# Altium schematic sheet DDR3.SchDoc: POLYSOME CRYPTO 01
size A3; Revision: V1; SheetNumber: 5; SheetTotal: 8; ProjectName: POLYSOME CRYPTO 01
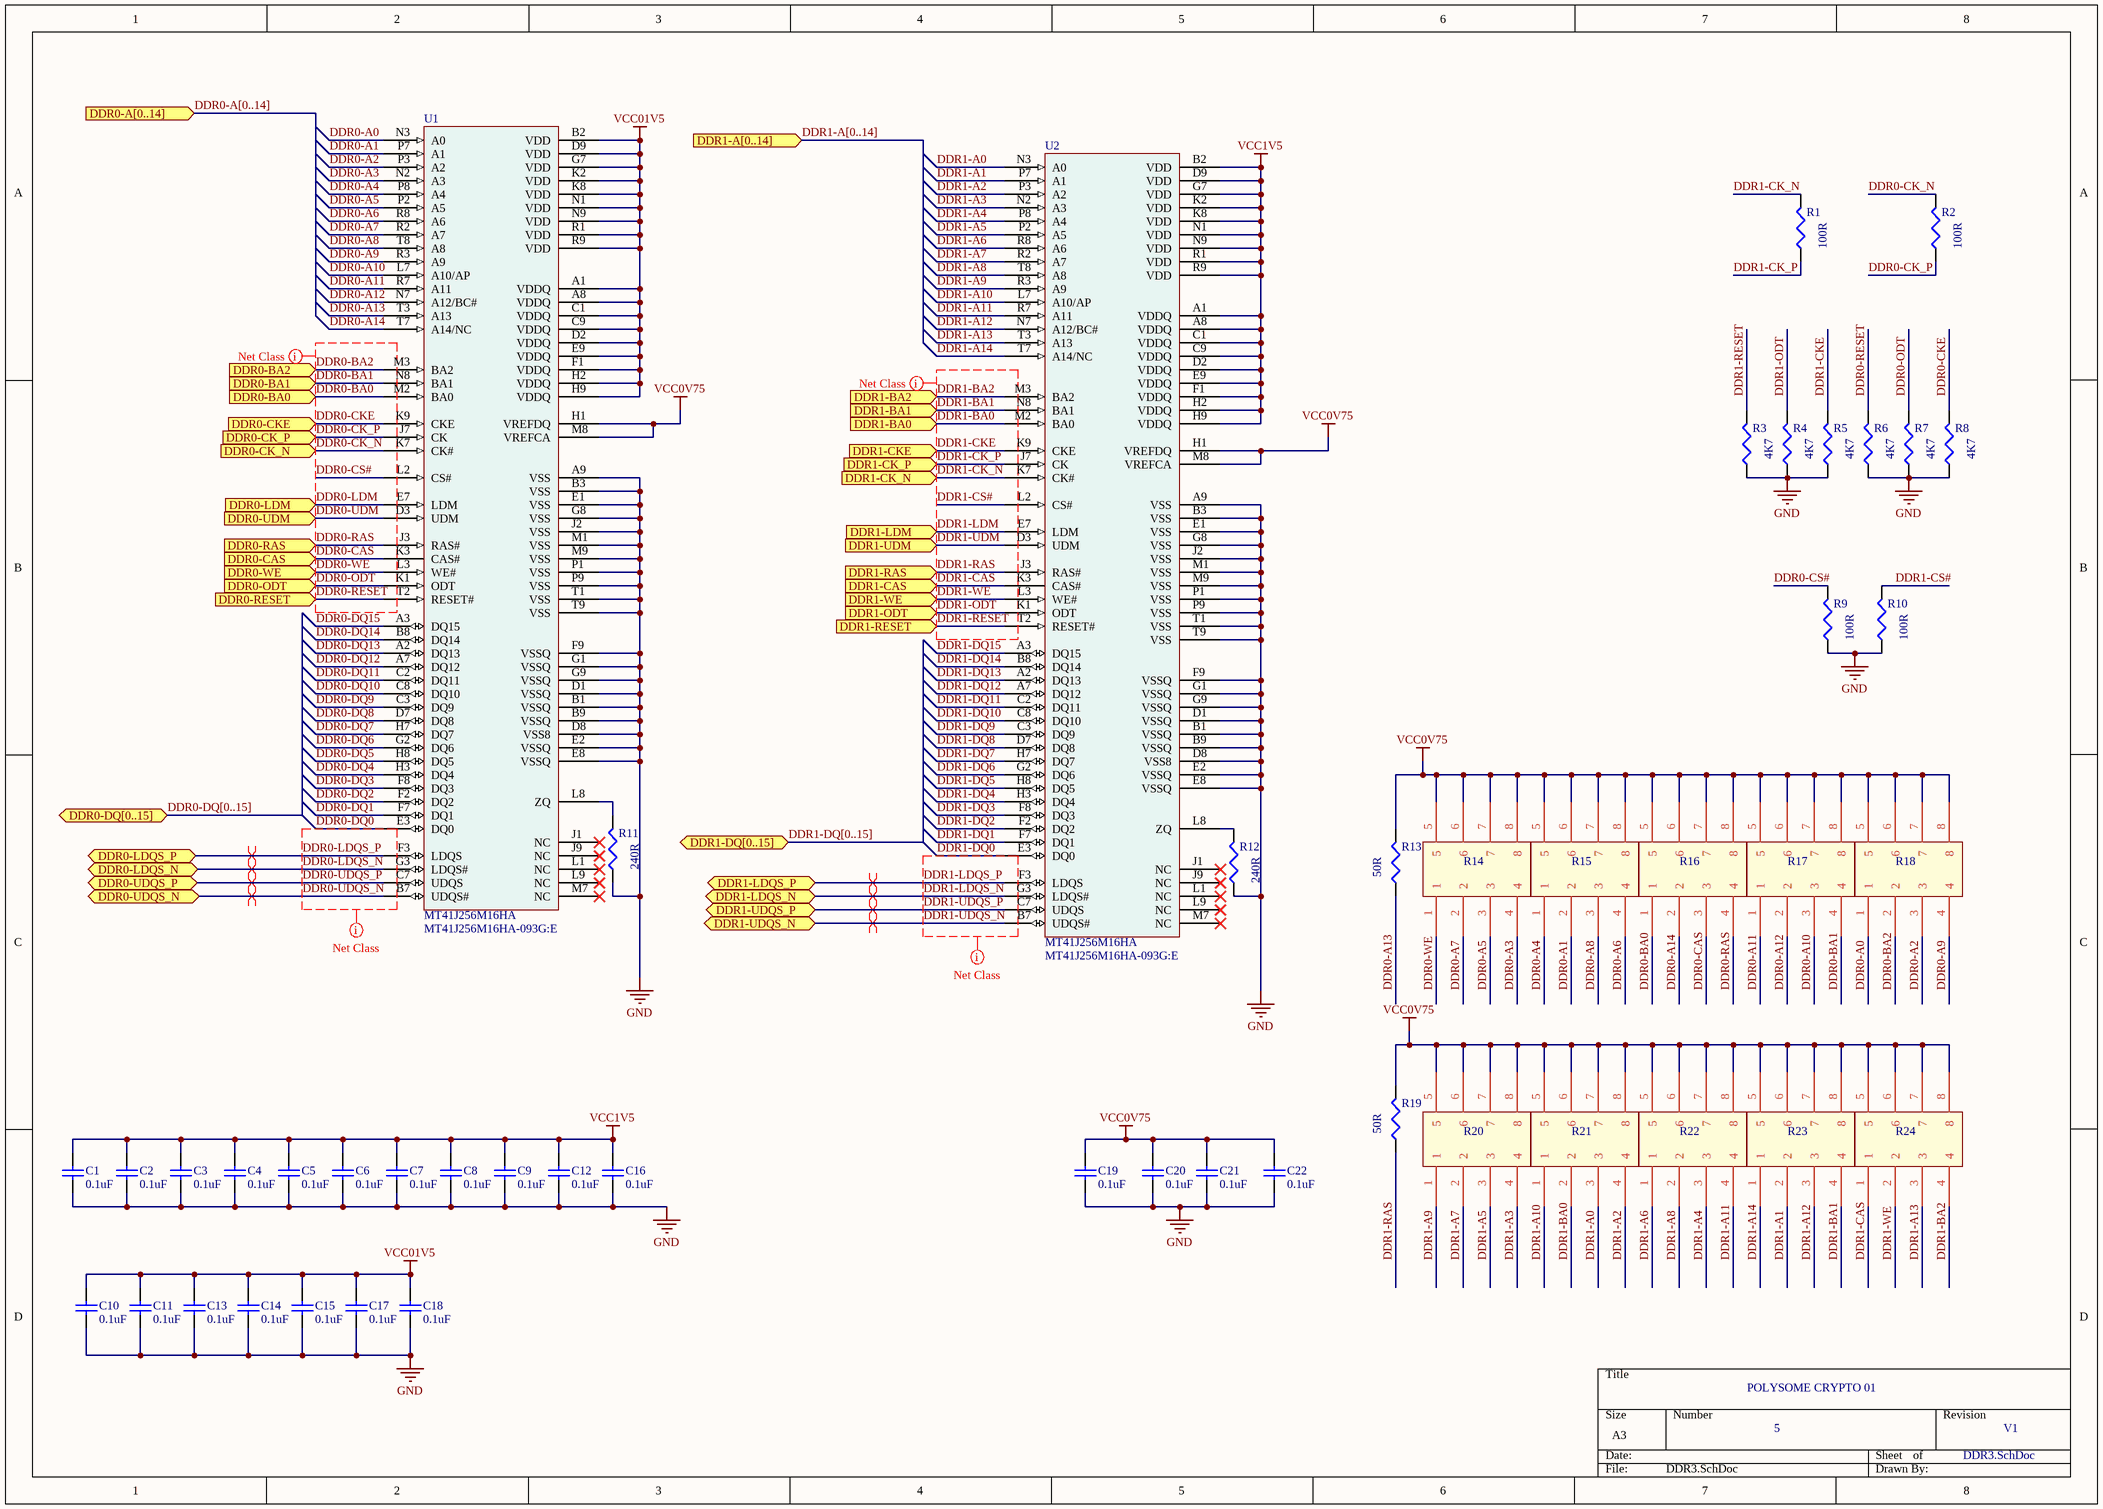
[diagram p0: DDR3.SchDoc]

## Parts
C1  value 0.1uF  [0402]  (hidden comment: Cap Semi)
C2  value 0.1uF  [0402]  (hidden comment: Cap Semi)
C3  value 0.1uF  [0402]  (hidden comment: Cap Semi)
C4  value 0.1uF  [0402]  (hidden comment: Cap Semi)
C5  value 0.1uF  [0402]  (hidden comment: Cap Semi)
C6  value 0.1uF  [0402]  (hidden comment: Cap Semi)
C7  value 0.1uF  [0402]  (hidden comment: Cap Semi)
C8  value 0.1uF  [0402]  (hidden comment: Cap Semi)
C9  value 0.1uF  [0402]  (hidden comment: Cap Semi)
C10  value 0.1uF  [0402]  (hidden comment: Cap Semi)
C11  value 0.1uF  [0402]  (hidden comment: Cap Semi)
C12  value 0.1uF  [0402]  (hidden comment: Cap Semi)
C13  value 0.1uF  [0402]  (hidden comment: Cap Semi)
C14  value 0.1uF  [0402]  (hidden comment: Cap Semi)
C15  value 0.1uF  [0402]  (hidden comment: Cap Semi)
C16  value 0.1uF  [0402]  (hidden comment: Cap Semi)
C17  value 0.1uF  [0402]  (hidden comment: Cap Semi)
C18  value 0.1uF  [0402]  (hidden comment: Cap Semi)
C19  value 0.1uF  [0402]  (hidden comment: Cap Semi)
C20  value 0.1uF  [0402]  (hidden comment: Cap Semi)
C21  value 0.1uF  [0402]  (hidden comment: Cap Semi)
C22  value 0.1uF  [0402]  (hidden comment: Cap Semi)
R1  value 100R  [0402]  (hidden comment: Res3)
R2  value 100R  [0402]  (hidden comment: Res3)
R3  value 4K7  [0402]  (hidden comment: Res3)
R4  value 4K7  [0402]  (hidden comment: Res3)
R5  value 4K7  [0402]  (hidden comment: Res3)
R6  value 4K7  [0402]  (hidden comment: Res3)
R7  value 4K7  [0402]  (hidden comment: Res3)
R8  value 4K7  [0402]  (hidden comment: Res3)
R9  value 100R  [0402]  (hidden comment: Res3)
R10  value 100R  [0402]  (hidden comment: Res3)
R11  value 240R  [0402]  (hidden comment: Res3)
R12  value 240R  [0402]  (hidden comment: Res3)
R13  value 50R  [0402]  (hidden comment: Res3)
R14  RES_4_PACK  [YC124-FR-0749R9L]  (value not drawn)
R15  RES_4_PACK  [YC124-FR-0749R9L]  (value not drawn)
R16  RES_4_PACK  [YC124-FR-0749R9L]  (value not drawn)
R17  RES_4_PACK  [YC124-FR-0749R9L]  (value not drawn)
R18  RES_4_PACK  [YC124-FR-0749R9L]  (value not drawn)
R19  value 50R  [0402]  (hidden comment: Res3)
R20  RES_4_PACK  [YC124-FR-0749R9L]  (value not drawn)
R21  RES_4_PACK  [YC124-FR-0749R9L]  (value not drawn)
R22  RES_4_PACK  [YC124-FR-0749R9L]  (value not drawn)
R23  RES_4_PACK  [YC124-FR-0749R9L]  (value not drawn)
R24  RES_4_PACK  [YC124-FR-0749R9L]  (value not drawn)
U1  MT41J256M16HA
U2  MT41J256M16HA

## Ports
DDR0-A[0..14] (in), DDR0-BA0 (in), DDR0-BA1 (in), DDR0-BA2 (in), DDR0-CAS (in), DDR0-CK_N (in), DDR0-CK_P (in), DDR0-CKE (in), DDR0-DQ[0..15] (bidir), DDR0-LDM (in), DDR0-LDQS_N (bidir), DDR0-LDQS_P (bidir), DDR0-ODT (in), DDR0-RAS (in), DDR0-RESET (in), DDR0-UDM (in), DDR0-UDQS_N (bidir), DDR0-UDQS_P (bidir), DDR0-WE (in), DDR1-A[0..14] (in), DDR1-BA0 (in), DDR1-BA1 (in), DDR1-BA2 (in), DDR1-CAS (in), DDR1-CK_N (in), DDR1-CK_P (in), DDR1-CKE (in), DDR1-DQ[0..15] (bidir), DDR1-LDM (in), DDR1-LDQS_N (bidir), DDR1-LDQS_P (bidir), DDR1-ODT (in), DDR1-RAS (in), DDR1-RESET (in), DDR1-UDM (in), DDR1-UDQS_N (bidir), DDR1-UDQS_P (bidir), DDR1-WE (in)

## Nets
GND: C1.1 C2.1 C3.1 C4.1 C5.1 C6.1 C7.1 C8.1 C9.1 C10.1 C11.1 C12.1 C13.1 C14.1 C15.1 C16.1 C17.1 C18.1 C19.2 C20.1 C21.1 C22.1 R3.1 R4.1 R5.1 R6.1 R7.1 R8.1 R9.1 R10.1 R11.1 R12.1 U1.A9(VSS) U1.B1(VSSQ) U1.B3(VSS) U1.B9(VSSQ) U1.D1(VSSQ) U1.D8(VSS8) U1.E1(VSS) U1.E2(VSSQ) U1.E8(VSSQ) U1.F9(VSSQ) U1.G1(VSSQ) U1.G8(VSS) U1.G9(VSSQ) U1.J2(VSS) U1.M1(VSS) U1.M9(VSS) U1.P1(VSS) U1.P9(VSS) U1.T1(VSS) U1.T9(VSS) U2.A9(VSS) U2.B1(VSSQ) U2.B3(VSS) U2.B9(VSSQ) U2.D1(VSSQ) U2.D8(VSS8) U2.E1(VSS) U2.E2(VSSQ) U2.E8(VSSQ) U2.F9(VSSQ) U2.G1(VSSQ) U2.G8(VSS) U2.G9(VSSQ) U2.J2(VSS) U2.M1(VSS) U2.M9(VSS) U2.P1(VSS) U2.P9(VSS) U2.T1(VSS) U2.T9(VSS)
VCC0V75: C19.1 C20.2 C21.2 C22.2 R13.2 R14.5 R14.6 R14.7 R14.8 R15.5 R15.6 R15.7 R15.8 R16.5 R16.6 R16.7 R16.8 R17.5 R17.6 R17.7 R17.8 R18.5 R18.6 R18.7 R18.8 R19.2 R20.5 R20.6 R20.7 R20.8 R21.5 R21.6 R21.7 R21.8 R22.5 R22.6 R22.7 R22.8 R23.5 R23.6 R23.7 R23.8 R24.5 R24.6 R24.7 R24.8 U1.H1(VREFDQ) U1.M8(VREFCA) U2.H1(VREFDQ) U2.M8(VREFCA)
VCC01V5: C10.2 C11.2 C13.2 C14.2 C15.2 C17.2 C18.2 U1.A1(VDDQ) U1.A8(VDDQ) U1.B2(VDD) U1.C1(VDDQ) U1.C9(VDDQ) U1.D2(VDDQ) U1.D9(VDD) U1.E9(VDDQ) U1.F1(VDDQ) U1.G7(VDD) U1.H2(VDDQ) U1.H9(VDDQ) U1.K2(VDD) U1.K8(VDD) U1.N1(VDD) U1.N9(VDD) U1.R1(VDD) U1.R9(VDD)
VCC1V5: C1.2 C2.2 C3.2 C4.2 C5.2 C6.2 C7.2 C8.2 C9.2 C12.2 C16.2 U2.A1(VDDQ) U2.A8(VDDQ) U2.B2(VDD) U2.C1(VDDQ) U2.C9(VDDQ) U2.D2(VDDQ) U2.D9(VDD) U2.E9(VDDQ) U2.F1(VDDQ) U2.G7(VDD) U2.H2(VDDQ) U2.H9(VDDQ) U2.K2(VDD) U2.K8(VDD) U2.N1(VDD) U2.N9(VDD) U2.R1(VDD) U2.R9(VDD)
DDR0-A0: R18.1 U1.N3(A0)
DDR0-A1: R15.2 U1.P7(A1)
DDR0-A2: R18.3 U1.P3(A2)
DDR0-A3: R14.4 U1.N2(A3)
DDR0-A4: R15.1 U1.P8(A4)
DDR0-A5: R14.3 U1.P2(A5)
DDR0-A6: R15.4 U1.R8(A6)
DDR0-A7: R14.2 U1.R2(A7)
DDR0-A8: R15.3 U1.T8(A8)
DDR0-A9: R18.4 U1.R3(A9)
DDR0-A10: R17.3 U1.L7(A10/AP)
DDR0-A11: R17.1 U1.R7(A11)
DDR0-A12: R17.2 U1.N7(A12/BC#)
DDR0-A13: R13.1 U1.T3(A13)
DDR0-A14: R16.2 U1.T7(A14/NC)
DDR0-BA0: R16.1 U1.M2(BA0) ; port DDR0-BA0
DDR0-BA1: R17.4 U1.N8(BA1) ; port DDR0-BA1
DDR0-BA2: R18.2 U1.M3(BA2) ; port DDR0-BA2
DDR0-CAS: R16.3 U1.K3(CAS#) ; port DDR0-CAS
DDR0-CK_N: R2.2 U1.K7(CK#) ; port DDR0-CK_N
DDR0-CK_P: R2.1 U1.J7(CK) ; port DDR0-CK_P
DDR0-CKE: R8.2 U1.K9(CKE) ; port DDR0-CKE
DDR0-CS#: R9.2 U1.L2(CS#)
DDR0-DQ0: U1.E3(DQ0)
DDR0-DQ1: U1.F7(DQ1)
DDR0-DQ2: U1.F2(DQ2)
DDR0-DQ3: U1.F8(DQ3)
DDR0-DQ4: U1.H3(DQ4)
DDR0-DQ5: U1.H8(DQ5)
DDR0-DQ6: U1.G2(DQ6)
DDR0-DQ7: U1.H7(DQ7)
DDR0-DQ8: U1.D7(DQ8)
DDR0-DQ9: U1.C3(DQ9)
DDR0-DQ10: U1.C8(DQ10)
DDR0-DQ11: U1.C2(DQ11)
DDR0-DQ12: U1.A7(DQ12)
DDR0-DQ13: U1.A2(DQ13)
DDR0-DQ14: U1.B8(DQ14)
DDR0-DQ15: U1.A3(DQ15)
DDR0-LDM: U1.E7(LDM) ; port DDR0-LDM
DDR0-LDQS_N: U1.G3(LDQS#) ; port DDR0-LDQS_N
DDR0-LDQS_P: U1.F3(LDQS) ; port DDR0-LDQS_P
DDR0-ODT: R7.2 U1.K1(ODT) ; port DDR0-ODT
DDR0-RAS: R16.4 U1.J3(RAS#) ; port DDR0-RAS
DDR0-RESET: R6.2 U1.T2(RESET#) ; port DDR0-RESET
DDR0-UDM: U1.D3(UDM) ; port DDR0-UDM
DDR0-UDQS_N: U1.B7(UDQS#) ; port DDR0-UDQS_N
DDR0-UDQS_P: U1.C7(UDQS) ; port DDR0-UDQS_P
DDR0-WE: R14.1 U1.L3(WE#) ; port DDR0-WE
DDR1-A0: R21.3 U2.N3(A0)
DDR1-A1: R23.2 U2.P7(A1)
DDR1-A2: R21.4 U2.P3(A2)
DDR1-A3: R20.4 U2.N2(A3)
DDR1-A4: R22.3 U2.P8(A4)
DDR1-A5: R20.3 U2.P2(A5)
DDR1-A6: R22.1 U2.R8(A6)
DDR1-A7: R20.2 U2.R2(A7)
DDR1-A8: R22.2 U2.T8(A8)
DDR1-A9: R20.1 U2.R3(A9)
DDR1-A10: R21.1 U2.L7(A10/AP)
DDR1-A11: R22.4 U2.R7(A11)
DDR1-A12: R23.3 U2.N7(A12/BC#)
DDR1-A13: R24.3 U2.T3(A13)
DDR1-A14: R23.1 U2.T7(A14/NC)
DDR1-BA0: R21.2 U2.M2(BA0) ; port DDR1-BA0
DDR1-BA1: R23.4 U2.N8(BA1) ; port DDR1-BA1
DDR1-BA2: R24.4 U2.M3(BA2) ; port DDR1-BA2
DDR1-CAS: R24.1 U2.K3(CAS#) ; port DDR1-CAS
DDR1-CK_N: R1.2 U2.K7(CK#) ; port DDR1-CK_N
DDR1-CK_P: R1.1 U2.J7(CK) ; port DDR1-CK_P
DDR1-CKE: R5.2 U2.K9(CKE) ; port DDR1-CKE
DDR1-CS#: R10.2 U2.L2(CS#)
DDR1-DQ0: U2.E3(DQ0)
DDR1-DQ1: U2.F7(DQ1)
DDR1-DQ2: U2.F2(DQ2)
DDR1-DQ3: U2.F8(DQ3)
DDR1-DQ4: U2.H3(DQ4)
DDR1-DQ5: U2.H8(DQ5)
DDR1-DQ6: U2.G2(DQ6)
DDR1-DQ7: U2.H7(DQ7)
DDR1-DQ8: U2.D7(DQ8)
DDR1-DQ9: U2.C3(DQ9)
DDR1-DQ10: U2.C8(DQ10)
DDR1-DQ11: U2.C2(DQ11)
DDR1-DQ12: U2.A7(DQ12)
DDR1-DQ13: U2.A2(DQ13)
DDR1-DQ14: U2.B8(DQ14)
DDR1-DQ15: U2.A3(DQ15)
DDR1-LDM: U2.E7(LDM) ; port DDR1-LDM
DDR1-LDQS_N: U2.G3(LDQS#) ; port DDR1-LDQS_N
DDR1-LDQS_P: U2.F3(LDQS) ; port DDR1-LDQS_P
DDR1-ODT: R4.2 U2.K1(ODT) ; port DDR1-ODT
DDR1-RAS: R19.1 U2.J3(RAS#) ; port DDR1-RAS
DDR1-RESET: R3.2 U2.T2(RESET#) ; port DDR1-RESET
DDR1-UDM: U2.D3(UDM) ; port DDR1-UDM
DDR1-UDQS_N: U2.B7(UDQS#) ; port DDR1-UDQS_N
DDR1-UDQS_P: U2.C7(UDQS) ; port DDR1-UDQS_P
DDR1-WE: R24.2 U2.L3(WE#) ; port DDR1-WE
NetR11_2: R11.2 U1.L8(ZQ)
NetR12_2: R12.2 U2.L8(ZQ)

Not connected (* = marked no-connect by the designer): U1 J1(NC)* J9(NC)* L1(NC)* L9(NC)* M7(NC)*; U2 J1(NC)* J9(NC)* L1(NC)* L9(NC)* M7(NC)*

## Buses and harness runs
bus DDR0-A[0..14] = port DDR0-A[0..14]
bus DDR0-DQ[0..15] = port DDR0-DQ[0..15]
bus DDR1-A[0..14] = port DDR1-A[0..14]
bus DDR1-DQ[0..15] = port DDR1-DQ[0..15]

## Layout directives
net class DDR0_CTRL: DDR0-BA0, DDR0-BA1, DDR0-BA2, DDR0-CAS, DDR0-CK_N, DDR0-CK_P, DDR0-CKE, DDR0-CS#, DDR0-DQ0, DDR0-LDM, DDR0-LDQS_N, DDR0-LDQS_P, DDR0-ODT, DDR0-RAS, DDR0-RESET, DDR0-UDM, DDR0-UDQS_N, DDR0-UDQS_P, DDR0-WE
net class DDR1_CTRL: DDR1-BA0, DDR1-BA1, DDR1-BA2, DDR1-CAS, DDR1-CK_N, DDR1-CK_P, DDR1-CKE, DDR1-CS#, DDR1-DQ0, DDR1-LDM, DDR1-LDQS_N, DDR1-LDQS_P, DDR1-ODT, DDR1-RAS, DDR1-RESET, DDR1-UDM, DDR1-UDQS_N, DDR1-UDQS_P, DDR1-WE
differential pair; net class DDR0_LDQS: DDR0-LDQS_N, DDR0-LDQS_P
differential pair; net class DDR0_UDQS: DDR0-UDQS_N, DDR0-UDQS_P
differential pair; net class DDR1_LDQS: DDR1-LDQS_N, DDR1-LDQS_P
differential pair; net class DDR1_UDQS: DDR1-UDQS_N, DDR1-UDQS_P

## Notes on the sheet
- POLYSOME CRYPTO 01

## Library data of the parts
C1-C22 = Cap Semi: Capacitor (Semiconductor SIM Model); Published: 8-Jun-2000; LatestRevisionDate: 29-May-2009; LatestRevisionNote: IPC-7351 Footprint Added.; PackageReference: C1206; Publisher: Altium Limited; PackageDescription: Chip Capacitor
R1-R13 R19 = Res3: Resistor; Published: 8-Jun-2000; LatestRevisionDate: 29-May-2009; LatestRevisionNote: IPC-7351 Footprint Added.; PackageReference: J1-0603; Publisher: Altium Limited; PackageDescription: Chip Resistor
R14-R18 R20-R24 = YC124-FR-0749R9L: Resistor Networks & Arrays 49.9 Ohm 1% 1/16W 50 Volts; Manufacturer: Yageo; Temperature Coefficient: 200 PPM / C; Voltage Rating: 25 V; Number of Resistors: 4; Case Height: 0.45 mm; Case Length: 2 mm; Case Width: 1 mm; Power per Element: 0.063 W (1/16 W); Resistor Values: 49.9 Ohms; Product Status: New at Mouser; Supplier 1: Mouser; Manufacturer Part Number: YC124-FR-0749R9L; RoHS: RoHS Compliant By Exemption; Category: Resistor Networks & Arrays; Stock 1: 0; Pricing 1: 10000=0.053, 20000=0.051, 50000=0.049, 100000=0.047 (AUD); Operating Temperature Range: - 55 C to + 155 C; Packaging: Reel; Product: Array Chip Resistors; Series: YC/TC164; Termination Style: SMD/SMT; Tolerance: 1 %; Brand: Yageo; Number of Pins: 8; Product Category: Resistor Arrays; Product Type: Arrays; RoHS - Mouser: Y; Minimum Order Quantity: 10000; Reeling: True; ComponentLink1URL: http://www.mouser.com/ds/2/447/PYu-YC_TC124_51_RoHS_L_2-519518.pdf; ComponentLink1Description: http://www.mouser.com/ds/2/447/PYu-YC_TC124_51_RoHS_L_2-519518.pdf; Supplier Part Number 1: 603-YC124-FR-0749R9L
U1 U2 = MT41J256M16HA-093G:E: IC DDR3 SDRAM 4GBIT FBGA; Manufacturer: Micron Technology Inc; Format - Memory: RAM; Memory Size: 4G (256M x 16); Speed: 1066MHz; Interface: Parallel; Voltage - Supply: 1.425 V ~ 1.575 V; Supplier 1: Digi-Key; RoHS: RoHS Compliant; Category: Integrated Circuits (ICs); Stock 1: 0; Pricing 1: 1000=9.33075 (USD); Packaging: Tray; Memory Type: DDR3 SDRAM; Operating Temperature: 0°C ~ 95°C; Package / Case: 96-TFBGA; Supplier Device Package: 96-FBGA (9x14); ComponentLink1URL: http://www.micron.com/~/media/Documents/Products/Data%20Sheet/DRAM/DDR3/4Gb_DDR3_SDRAM.pdf; ComponentLink1Description: http://www.micron.com/~/media/Documents/Products/Data%20Sheet/DRAM/DDR3/4Gb_DDR3_SDRAM.pdf; Supplier Part Number 1: MT41J256M16HA-093G:E-ND; Manufacturer Part Number: MT41J256M16HA-093G:E